# Altium project otis_v4.PrjPCB
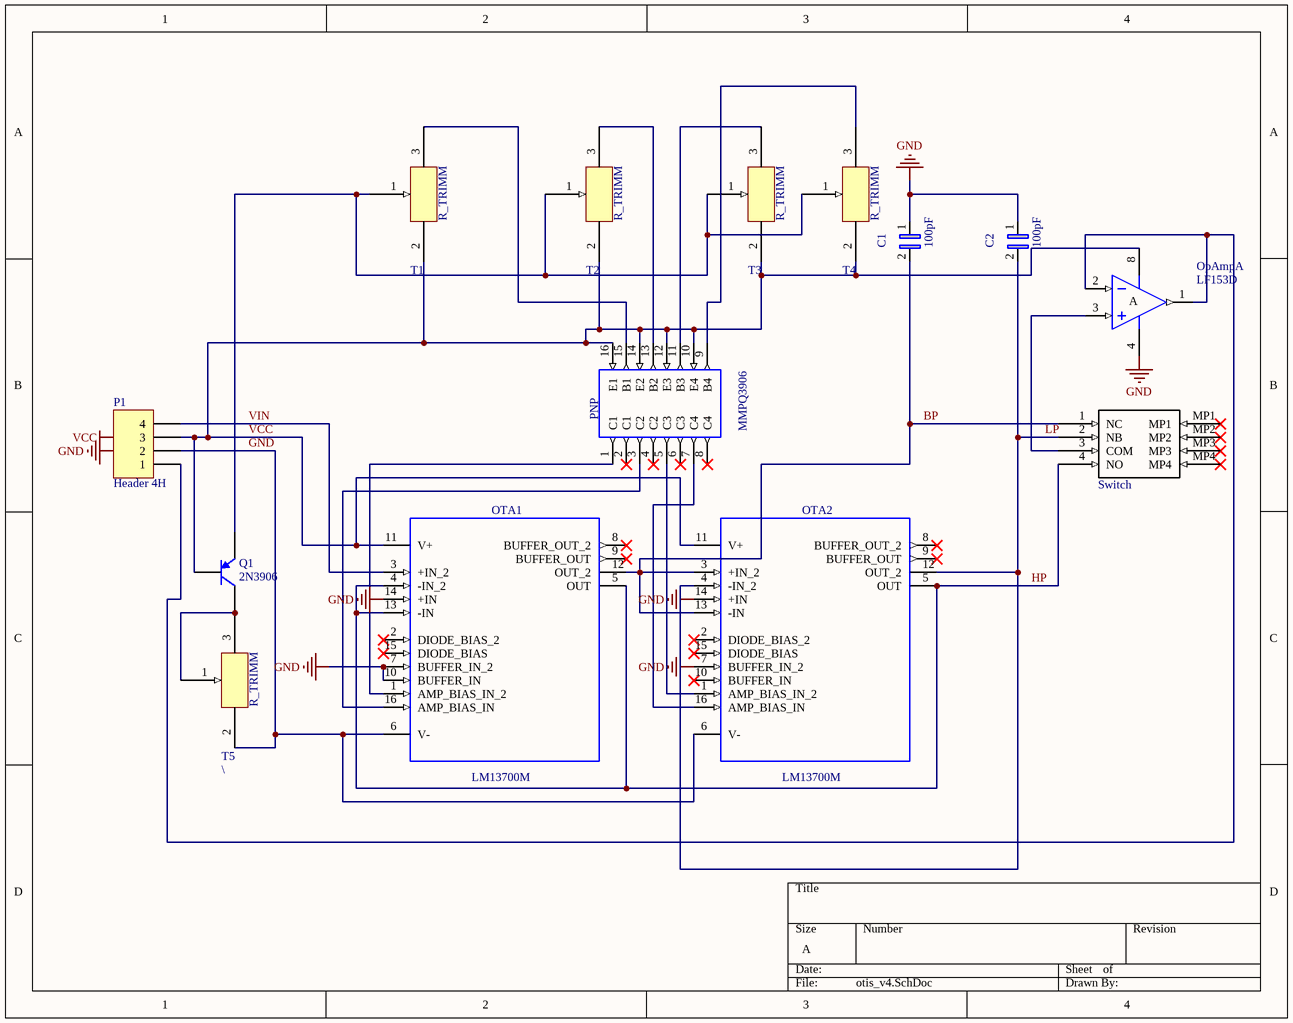
[diagram p0: otis_v4.SchDoc]
1 sheet, 14 parts. Net scope: global (net labels, ports and power ports of the same name join across sheets).
Board file: otis_v4.PcbDoc

## Sheet otis_v4.SchDoc
size A

### Parts
C1  100pF  [_C*CAPC1005X55N_CC0402C100K5GACAUTO_CPrimary_C]
C2  100pF  [_C*CAPC1005X55N_CC0402C100K5GACAUTO_CPrimary_C]
OpAmp  LF153D  [SO8_N]  (part A of 2)
OTA1  LM13700M  [LM13700LM13700MLM13700LM13700MLM13700PrimaryLM13700]
OTA2  LM13700M  [LM13700LM13700MLM13700LM13700MLM13700PrimaryLM13700]
P1  Header 4H  [HDR1X4H]
PNP  MMPQ3906  [LM13700LM13700MLM13700LM13700MLM13700PrimaryLM13700]
Q1  2N3906  [TO-92A]
T1  (no value)  [PCBComponent_1]
T2  (no value)  [PCBComponent_1]
T3  (no value)  [PCBComponent_1]
T4  (no value)  [PCBComponent_1]
T5  \  [PCBComponent_1]
  Switch  [PCBComponent_1]

### Nets
GND: C1.1 C2.1 OpAmp.4(V-) OTA1.6(V-) OTA1.7(BUFFER_IN_2) OTA1.10(BUFFER_IN) OTA1.14(+IN) OTA2.6(V-) OTA2.7(BUFFER_IN_2) OTA2.14(+IN) P1.2
VCC: OpAmp.8(V+) OTA1.11(V+) OTA2.11(V+) P1.3 PNP.10(E4) PNP.12(E3) PNP.14(E2) PNP.16(E1) Q1.2(B)
BP: C1.2 OTA1.12(OUT_2) OTA2.3(+IN_2) OTA2.13(-IN) .1(NC)
HP: OTA1.4(-IN_2) OTA1.5(OUT) OTA1.13(-IN) OTA2.5(OUT) .4(NO)
LP: C2.2 OTA2.4(-IN_2) OTA2.12(OUT_2) .2(NB)
VIN: OTA1.3(+IN_2) P1.4
NetOpAmp_1: OpAmp.1(OUT) OpAmp.2(IN-) P1.1
NetOpAmp_3: OpAmp.3(IN+) .3(COM)
NetOTA1_1: OTA1.1(AMP_BIAS_IN_2) PNP.1(C1)
NetOTA1_16: OTA1.16(AMP_BIAS_IN) PNP.3(C2)
NetOTA2_1: OTA2.1(AMP_BIAS_IN_2) PNP.5(C3)
NetOTA2_16: OTA2.16(AMP_BIAS_IN) PNP.7(C4)
NetPNP_9: PNP.9(B4) T4.3
NetPNP_11: PNP.11(B3) T3.3
NetPNP_13: PNP.13(B2) T2.3
NetPNP_15: PNP.15(B1) T1.3
NetQ1_1: Q1.1(E) T1.1 T2.1 T3.1 T4.1
NetQ1_3: Q1.3(C) T5.1 T5.3

Not connected (* = marked no-connect by the designer): OTA1 2(DIODE_BIAS_2)* 8(BUFFER_OUT_2)* 9(BUFFER_OUT)* 15(DIODE_BIAS)*; OTA2 2(DIODE_BIAS_2)* 8(BUFFER_OUT_2)* 9(BUFFER_OUT)* 10(BUFFER_IN)* 15(DIODE_BIAS)*; PNP 2(C1)* 4(C2)* 6(C3)* 8(C4)*; T1 2; T2 2; T3 2; T4 2; T5 2;  MP1* MP2* MP3* MP4*

### Notes on the sheet
- Labels drawn without touching a wire or pin: GND, VCC
- (in symbol Component_1) R_TRIMM
- (in symbol LF153D, part A) A

### Library data of the parts
C1 C2 = C0402C100K5GACAUTO: CAPACITOR CERAMIC 10 PF 10% TOL 50V C0G 0402; MF: KEMET; SnapEDA_Link: https://www.snapeda.com/parts/C0402C100K5GACAUTO/KEMET/view-part/?ref=snap; Availability: Unavailable; MP: C0402C100K5GACAUTO; Package: 0402 KEMET; Price: None; Value: *
OpAmp = LF153D: Wide-Bandwidth Dual J-FET Operational Amplifier; Published: 24-Aug-2001; LatestRevisionDate: 13-Apr-2006; LatestRevisionNote: IPC-7351 Footprint Added.; DatasheetVersion: Jun-1998; PackageVersion: Dec-2002; PackageReference: SO8; Publisher: Altium Limited; PackageDescription: 8-Pin Small Outline Integrated Circuit 1.27 mm Pitch; Code_JEDEC: MS-012-AA; Code_IPC: SOIC127P600-8; ComponentLink1Description: Manufacturer Link; ComponentLink1URL: http://www.st.com/; ComponentLink2Description: Datasheet; ComponentLink2URL: http://www.st.com/stonline/products/literature/ds/2153/lf353.pdf
OTA1 OTA2 PNP = LM13700M: Dual Operational Transconductance Amplifier with Linearizing Diodes and Buffers 16-SOIC 0 to 70; MF: Texas Instruments; Price: None; Availability: Unavailable; MP: LM13700M; Package: SOIC-16 Texas Instruments; SnapEDA_Link: https://www.snapeda.com/parts/LM13700M/Texas%20Instruments/view-part/?ref=snap; Value: *
P1 = Header 4H: Header, 4-Pin, Right Angle; LatestRevisionDate: 17-Jul-2002; LatestRevisionNote: Re-released for DXP Platform.; Publisher: Altium Limited
Q1 = 2N3906: PNP General Purpose Amplifier; Published: 8-Jun-2000; LatestRevisionDate: 15-Jan-2003; LatestRevisionNote: PCB Footprint 'BCY-W3/D4.7' replaced; DatasheetDocument: 1997; PackageDocument: Sep-1998; PackageReference: TO-92A; Publisher: Altium Limited; Code_JEDEC: TO-92A; ComponentLink1Description: Manufacturer Link; ComponentLink1URL: http://www.fairchildsemi.com/; ComponentLink2Description: Datasheet; ComponentLink2URL: http://www.fairchildsemi.com/ds/2N%2F2N3906.pdf
T1-T5  = Component_1